# EAGLE design pendant (EAGLE 7.2.0)
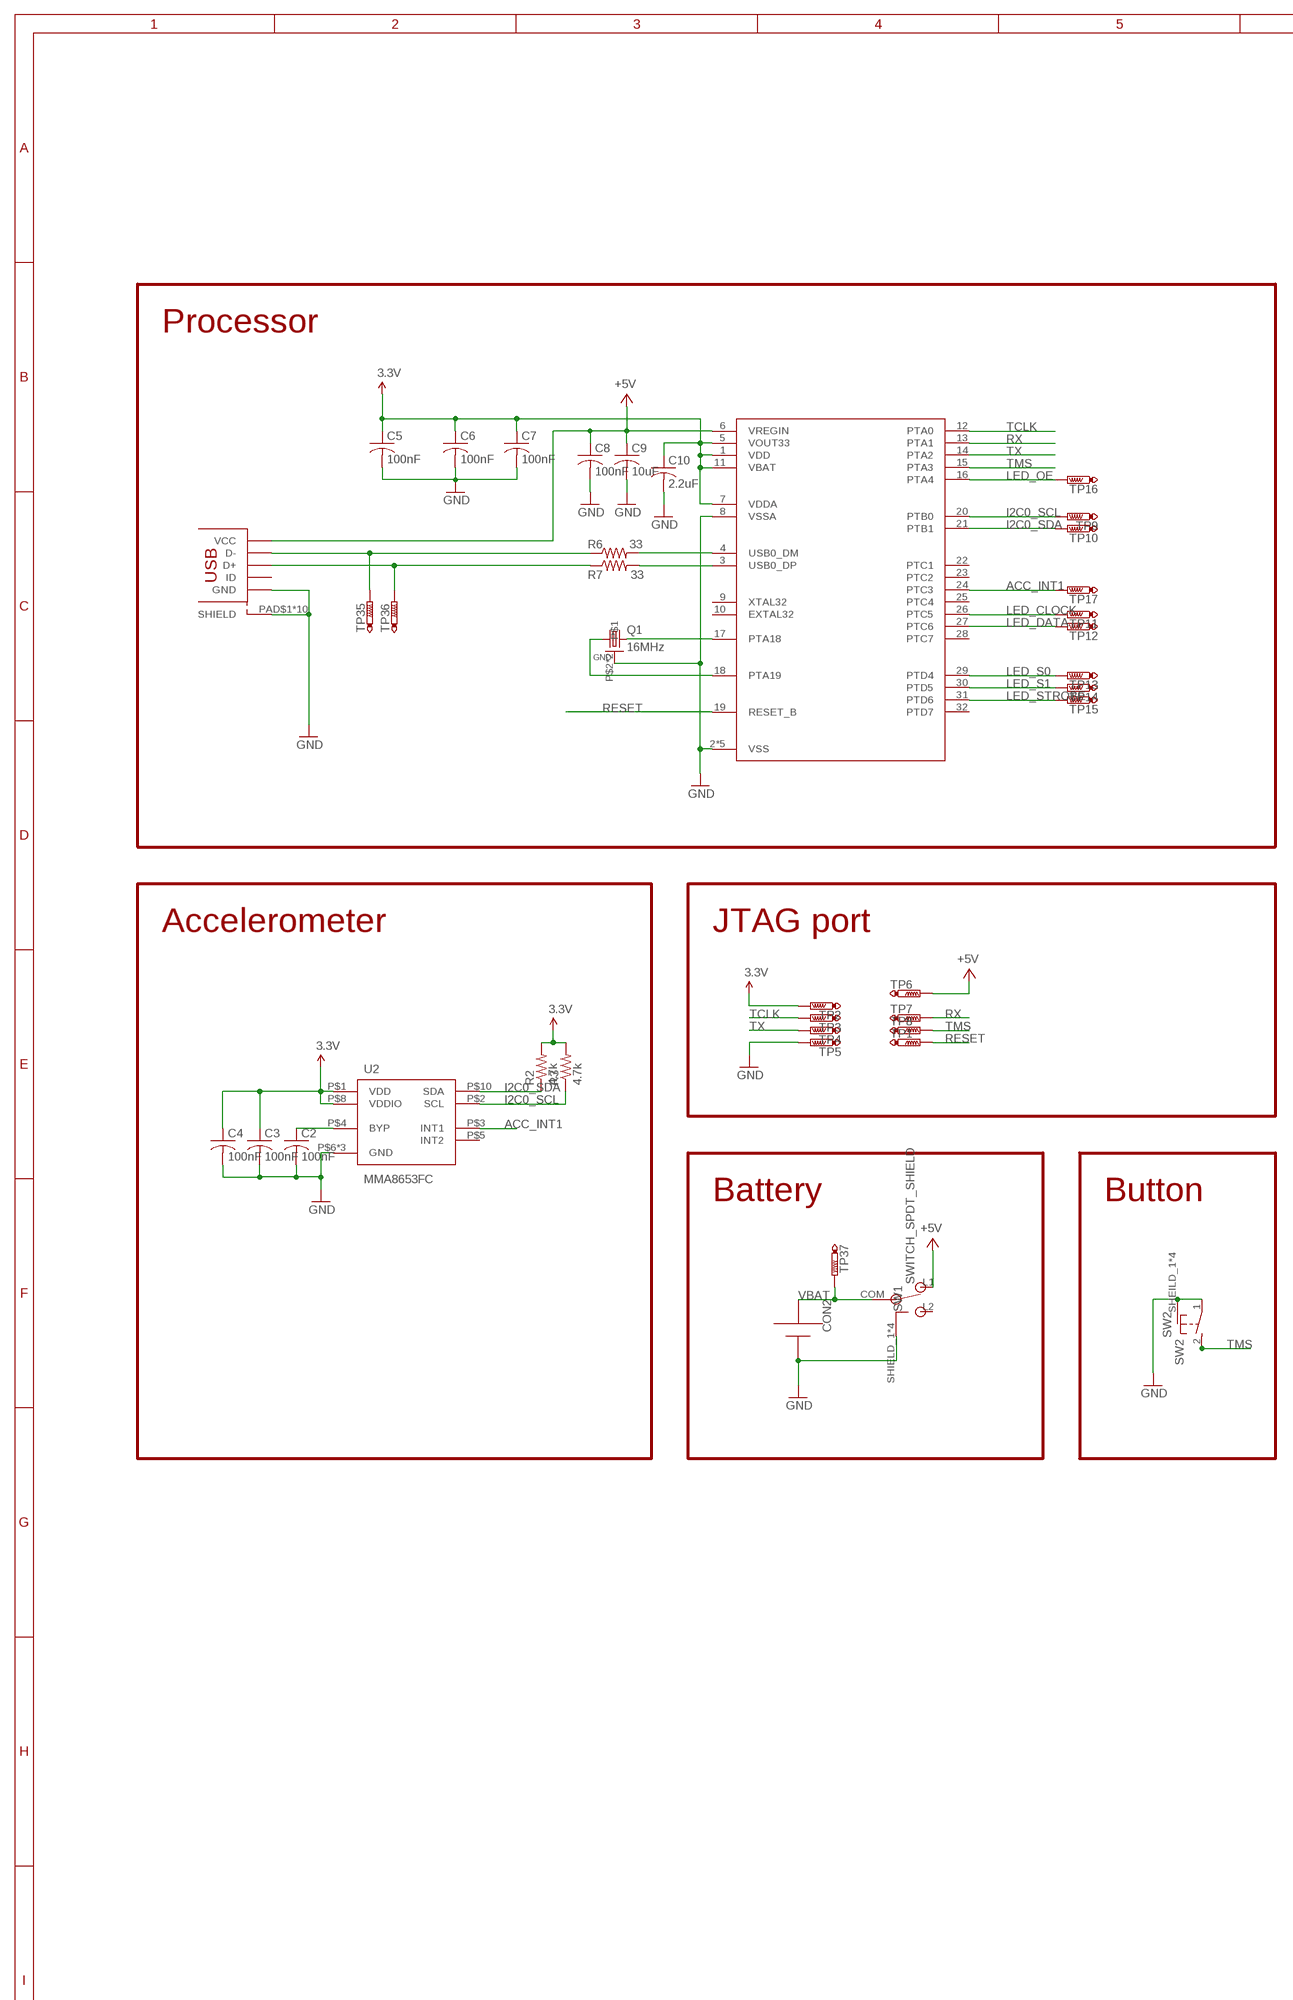
[diagram p0: schematic, sheet 1, part 1 of 2]
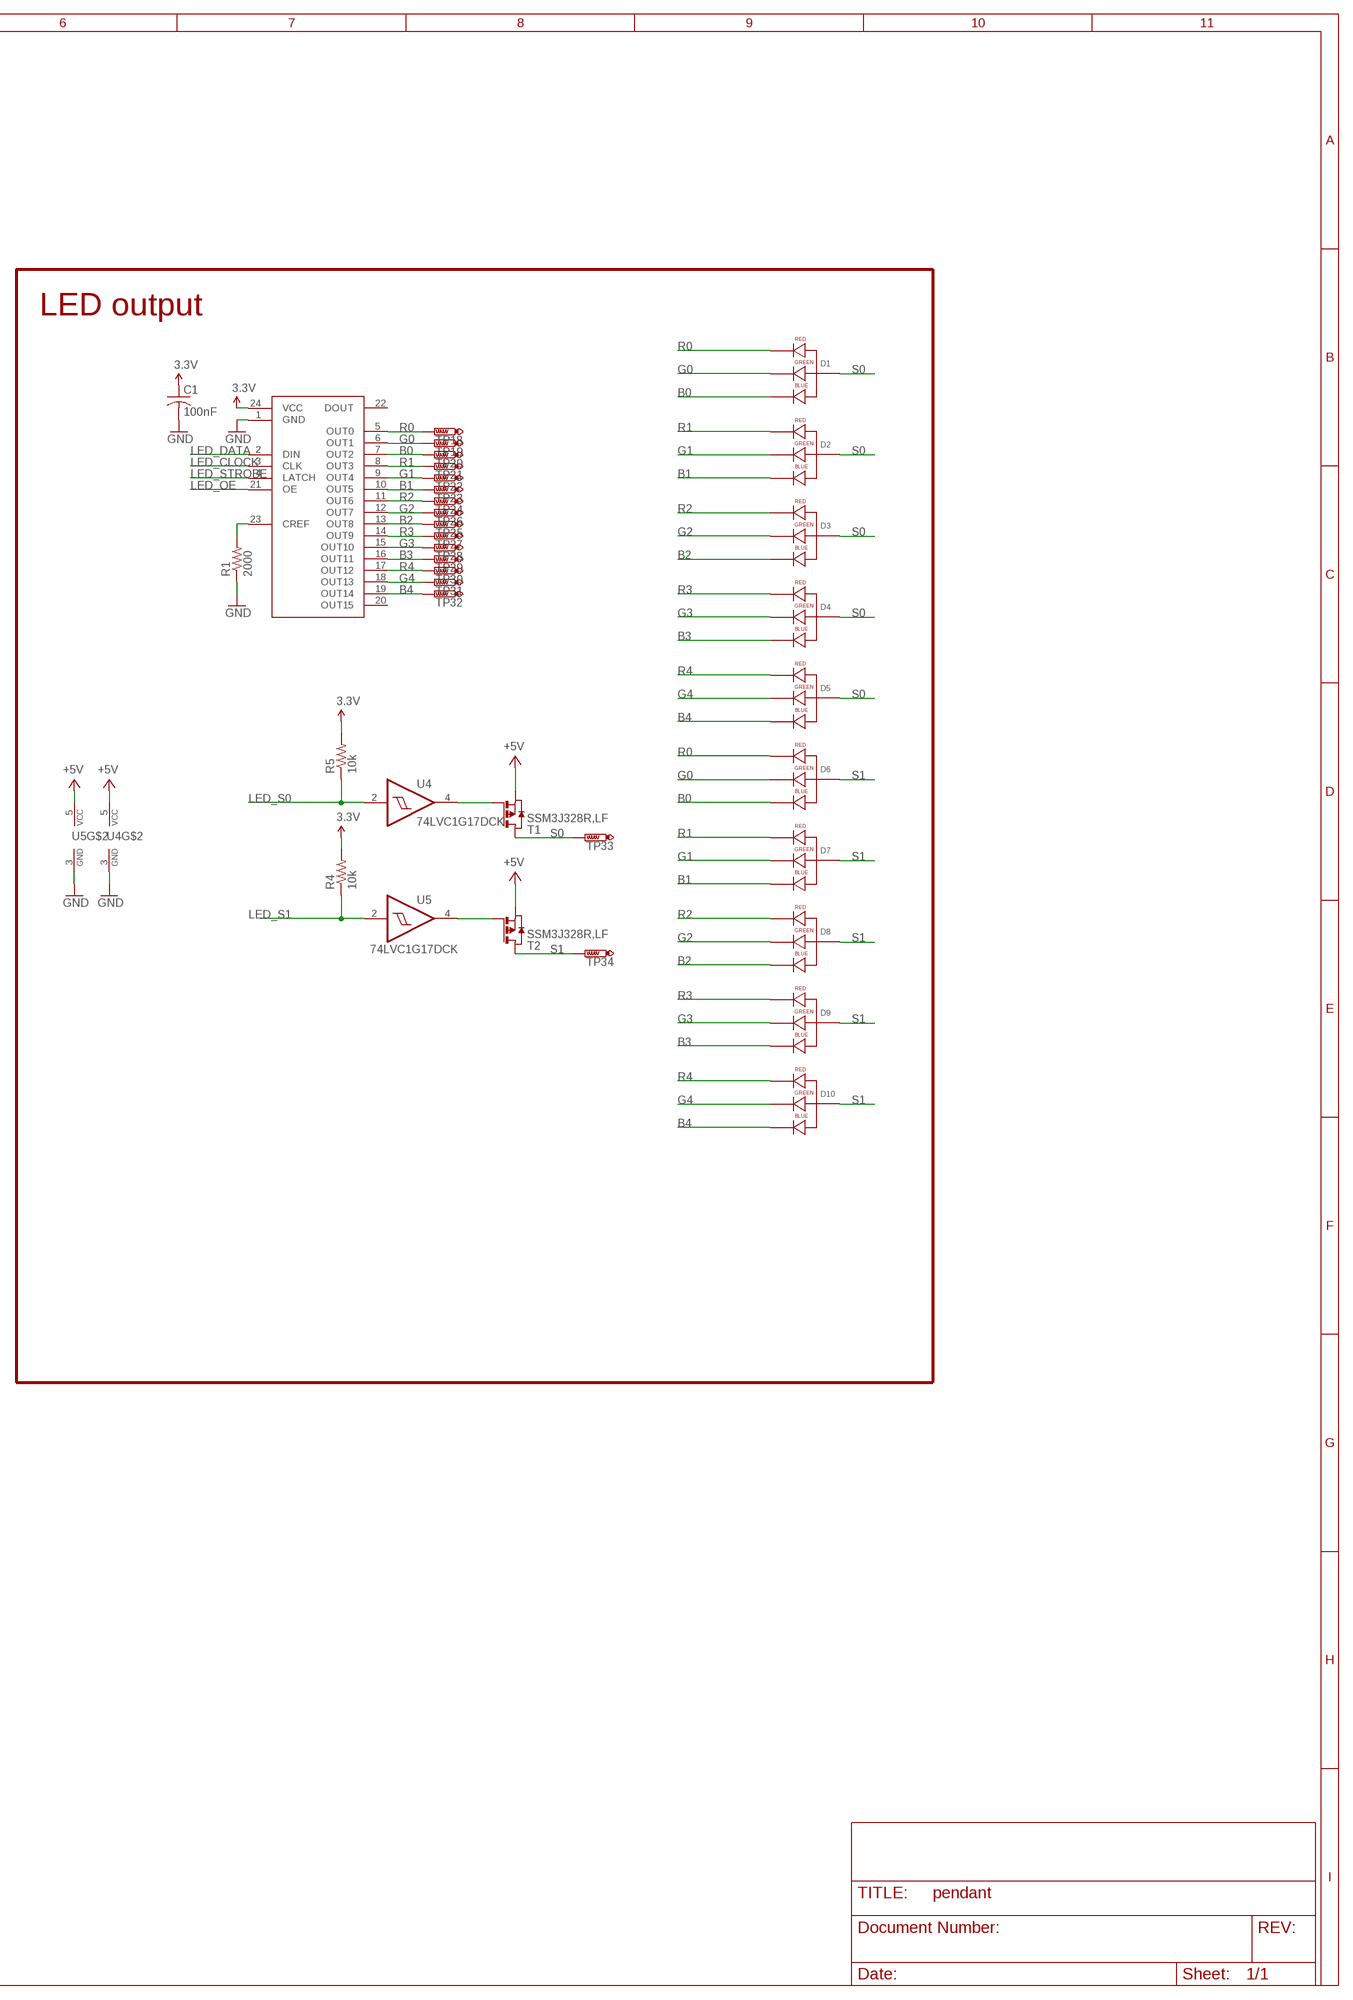
[diagram p1: schematic, sheet 1, part 2 of 2]

## Parts
C1  100nF  C-USC0402  [C0402]
C2  100nF  C-USC0402  [C0402]
C3  100nF  C-USC0402  [C0402]
C4  100nF  C-USC0402  [C0402]
C5  100nF  C-USC0402  [C0402]
C6  100nF  C-USC0402  [C0402]
C7  100nF  C-USC0402  [C0402]
C8  100nF  C-USC0402  [C0402]
C9  10uF  C-USC0603  [C0603]
C10  2.2uF  C-USC0402  [C0402]
CON1  USB_MICROSMT+THRUHULE  [USB_MICRO_THRUHOLE]
CON2  CR2032X2  [CR2032X2]
D1  LED-RGB5050  [LED-TRICOLOR-5050-FIXED]
D2  LED-RGB5050  [LED-TRICOLOR-5050-FIXED]
D3  LED-RGB5050  [LED-TRICOLOR-5050-FIXED]
D4  LED-RGB5050  [LED-TRICOLOR-5050-FIXED]
D5  LED-RGB5050  [LED-TRICOLOR-5050-FIXED]
D6  LED-RGB5050  [LED-TRICOLOR-5050-FIXED]
D7  LED-RGB5050  [LED-TRICOLOR-5050-FIXED]
D8  LED-RGB5050  [LED-TRICOLOR-5050-FIXED]
D9  LED-RGB5050  [LED-TRICOLOR-5050-FIXED]
D10  LED-RGB5050  [LED-TRICOLOR-5050-FIXED]
Q1  16MHz  CRYSTAL_4PAD  [CRYSTAL_3225]
R1  2000  R-US_R0402  [R0402]
R2  4.7k  R-US_R0402  [R0402]
R3  4.7k  R-US_R0402  [R0402]
R4  10k  R-US_R0402  [R0402]
R5  10k  R-US_R0402  [R0402]
R6  33  R-US_R0402  [R0402]
R7  33  R-US_R0402  [R0402]
SW1  SWITCH_SPDT_SHIELD  [SWITCH_SMD_90_DEGREE]
SW2  SW2  BUTTON_MOMENTARY_GROUND  [BUTTON_MOMENTARY_MP5]
T1  SSM3J328R,LF  PMOSSOT23  [SOT-23]
T2  SSM3J328R,LF  PMOSSOT23  [SOT-23]
TP1  PTR1B1,27  [B1,27]
TP2  PTR1B1,27  [B1,27]
TP3  PTR1B1,27  [B1,27]
TP4  PTR1B1,27  [B1,27]
TP5  PTR1B1,27  [B1,27]
TP6  PTR1B1,27  [B1,27]
TP7  PTR1B1,27  [B1,27]
TP8  PTR1B1,27  [B1,27]
TP9  PTR1B1,27  [B1,27]
TP10  PTR1B1,27  [B1,27]
TP11  PTR1B1,27  [B1,27]
TP12  PTR1B1,27  [B1,27]
TP13  PTR1B1,27  [B1,27]
TP14  PTR1B1,27  [B1,27]
TP15  PTR1B1,27  [B1,27]
TP16  PTR1B1,27  [B1,27]
TP17  PTR1B1,27  [B1,27]
TP18  PTR1B1,27  [B1,27]
TP19  PTR1B1,27  [B1,27]
TP20  PTR1B1,27  [B1,27]
TP21  PTR1B1,27  [B1,27]
TP22  PTR1B1,27  [B1,27]
TP23  PTR1B1,27  [B1,27]
TP24  PTR1B1,27  [B1,27]
TP25  PTR1B1,27  [B1,27]
TP26  PTR1B1,27  [B1,27]
TP27  PTR1B1,27  [B1,27]
TP28  PTR1B1,27  [B1,27]
TP29  PTR1B1,27  [B1,27]
TP30  PTR1B1,27  [B1,27]
TP31  PTR1B1,27  [B1,27]
TP32  PTR1B1,27  [B1,27]
TP33  PTR1B1,27  [B1,27]
TP34  PTR1B1,27  [B1,27]
TP35  PTR1B1,27  [B1,27]
TP36  PTR1B1,27  [B1,27]
TP37  PTR1B1,27  [B1,27]
U1  MK20D--VFM5  [QFN32_5X5_LONGLEADS]
U2  MMA8653FC  [VFDFN-10]
U3  ICN2026DF  [SMD-24-1MM]
U4  74LVC1G17DCK  [SC70-5]
U5  74LVC1G17DCK  [SC70-5]

## Nets
3.3V [power]: C1.1 C3.1 C4.1 C5.1 C6.1 C7.1 C10.1 R2.2 R3.2 R4.2 R5.2 TP2.TP U1.1(VDD) U1.5(VOUT33) U1.7(VDDA) U1.11(VBAT) U2.P$1(VDD) U2.P$8(VDDIO) U3.24(VCC)
+5V [power]: C8.1 C9.1 CON1.PIN$1(VCC) SW1.L1 T1.2(S) T2.2(S) TP6.TP U1.6(VREGIN) U4.5(VCC) U5.5(VCC)
ACC_INT1: TP17.TP U1.24(PTC3) U2.P$3(INT1)
B0: D1.1(BLUE_CATHODE) D6.1(BLUE_CATHODE) TP20.TP U3.7(OUT2)
B1: D2.1(BLUE_CATHODE) D7.1(BLUE_CATHODE) TP23.TP U3.10(OUT5)
B2: D3.1(BLUE_CATHODE) D8.1(BLUE_CATHODE) TP25.TP U3.13(OUT8)
B3: D4.1(BLUE_CATHODE) D9.1(BLUE_CATHODE) TP29.TP U3.16(OUT11)
B4: D5.1(BLUE_CATHODE) D10.1(BLUE_CATHODE) TP32.TP U3.19(OUT14)
G0: D1.3(GREEN_CATHODE) D6.3(GREEN_CATHODE) TP19.TP U3.6(OUT1)
G1: D2.3(GREEN_CATHODE) D7.3(GREEN_CATHODE) TP22.TP U3.9(OUT4)
G2: D3.3(GREEN_CATHODE) D8.3(GREEN_CATHODE) TP26.TP U3.12(OUT7)
G3: D4.3(GREEN_CATHODE) D9.3(GREEN_CATHODE) TP28.TP U3.15(OUT10)
G4: D5.3(GREEN_CATHODE) D10.3(GREEN_CATHODE) TP31.TP U3.18(OUT13)
GND [power]: C1.2 C2.2 C3.2 C4.2 C5.2 C6.2 C7.2 C8.2 C9.2 C10.2 CON1.PAD$1(SHIELD) CON1.PAD$2(SHIELD) CON1.PAD$3(SHIELD) CON1.PAD$4(SHIELD) CON1.PAD$5(SHIELD) CON1.PAD$6(SHIELD) CON1.PAD$7(SHIELD) CON1.PAD$8(SHIELD) CON1.PAD$9(SHIELD) CON1.PAD$10(SHIELD) CON1.PIN$5(GND) CON2.- Q1.P$2 Q1.P$4 R1.1 SW1.SHIELD_1(SHIELD) SW1.SHIELD_2(SHIELD) SW1.SHIELD_3(SHIELD) SW1.SHIELD_4(SHIELD) SW2.1(P) SW2.SHEILD_1(SHIELD) SW2.SHEILD_2(SHIELD) SW2.SHEILD_3(SHIELD) SW2.SHEILD_4(SHIELD) TP5.TP U1.2(VSS) U1.8(VSSA) U1.PAD@1(VSS) U1.PAD@4(VSS) U1.PAD@9(VSS) U1.PAD@11(VSS) U2.P$6(GND) U2.P$7(GND) U2.P$9(GND) U3.1(GND) U4.3(GND) U5.3(GND)
I2C0_SCL: R3.1 TP9.TP U1.20(PTB0) U2.P$2(SCL)
I2C0_SDA: R2.1 TP10.TP U1.21(PTB1) U2.P$10(SDA)
LED_CLOCK: TP11.TP U1.26(PTC5) U3.3(CLK)
LED_DATA: TP12.TP U1.27(PTC6) U3.2(DIN)
LED_OE: TP16.TP U1.16(PTA4) U3.21(OE)
LED_S0: R5.1 TP13.TP U1.29(PTD4) U4.2(I)
LED_S1: R4.1 TP14.TP U1.30(PTD5) U5.2(I)
LED_STROBE: TP15.TP U1.31(PTD6) U3.4(LATCH)
N$1: T2.3(G) U5.4(O)
N$4: C2.1 U2.P$4(BYP)
N$6: T1.3(G) U4.4(O)
N$8: Q1.P$3 U1.17(PTA18)
N$13: Q1.P$1 U1.18(PTA19)
N$14: CON1.PIN$3(D+) R7.1 TP36.TP
N$15: R6.2 U1.4(USB0_DM)
N$17: R7.2 U1.3(USB0_DP)
N$18: R1.2 U3.23(CREF)
N$21: CON1.PIN$2(D-) R6.1 TP35.TP
R0: D1.2(RED_CATHODE) D6.2(RED_CATHODE) TP18.TP U3.5(OUT0)
R1: D2.2(RED_CATHODE) D7.2(RED_CATHODE) TP21.TP U3.8(OUT3)
R2: D3.2(RED_CATHODE) D8.2(RED_CATHODE) TP24.TP U3.11(OUT6)
R3: D4.2(RED_CATHODE) D9.2(RED_CATHODE) TP27.TP U3.14(OUT9)
R4: D5.2(RED_CATHODE) D10.2(RED_CATHODE) TP30.TP U3.17(OUT12)
RESET: TP1.TP U1.19(RESET_B)
RX: TP7.TP U1.13(PTA1)
S0: D1.4(ANODE) D1.5(ANODE) D1.6(ANODE) D2.4(ANODE) D2.5(ANODE) D2.6(ANODE) D3.4(ANODE) D3.5(ANODE) D3.6(ANODE) D4.4(ANODE) D4.5(ANODE) D4.6(ANODE) D5.4(ANODE) D5.5(ANODE) D5.6(ANODE) T1.1(D) TP33.TP
S1: D6.4(ANODE) D6.5(ANODE) D6.6(ANODE) D7.4(ANODE) D7.5(ANODE) D7.6(ANODE) D8.4(ANODE) D8.5(ANODE) D8.6(ANODE) D9.4(ANODE) D9.5(ANODE) D9.6(ANODE) D10.4(ANODE) D10.5(ANODE) D10.6(ANODE) T2.1(D) TP34.TP
TCLK: TP3.TP U1.12(PTA0)
TMS: SW2.2(S) TP8.TP U1.15(PTA3)
TX: TP4.TP U1.14(PTA2)
VBAT: CON2.+ SW1.COM TP37.TP
Unconnected: CON1.PIN$4(ID) SW1.L2 U1.9(XTAL32) U1.10(EXTAL32) U1.22(PTC1) U1.23(PTC2) U1.25(PTC4) U1.28(PTC7) U1.32(PTD7) U2.P$5(INT2) U3.20(OUT15) U3.22(DOUT)

## Notes on the sheet
- Processor | LED output
- Accelerometer | JTAG port
- Battery | Button

## Library data of the parts
C1-C10 = adafruit:C-US: CAPACITOR, American symbol
CON1 = blinkinlabs:USB_MICRO
CON2 = blinkinlabs:CR2032X2
D1-D10 = blinkinlabs:LED-RGB: RGB Through-hole common anode SparkFun store front COM-10821 (diffuse) COM-10820 (clear)
Q1 = blinkinlabs:CRYSTAL_4PAD
R1-R7 = adafruit:R-US_: RESISTOR, American symbol
SW1 = blinkinlabs:SWITCH_SPDT_SHIELD
SW2 = blinkinlabs:BUTTON_MOMENTARY_GROUND
T1 T2 = zetex:PMOSSOT23: MOS FET; OC_FARNELL: unknown; OC_NEWARK: unknown
TP1-TP37 = testpad:PTR1: TEST PIN
U1 = blinkinlabs:MK20D--VFM5
U2 = teensy_adapter:MMA8653FC
U3 = teensy_adapter:ICN2026DF
U4 U5 = 74xx-little-us:74*1G17: Single Schmitt-Trigger Buffer

## Net classes
0 default: width 0.254 mm, drill 0.35 mm
1 power: width 0.254 mm, drill 0.35 mm

## Board
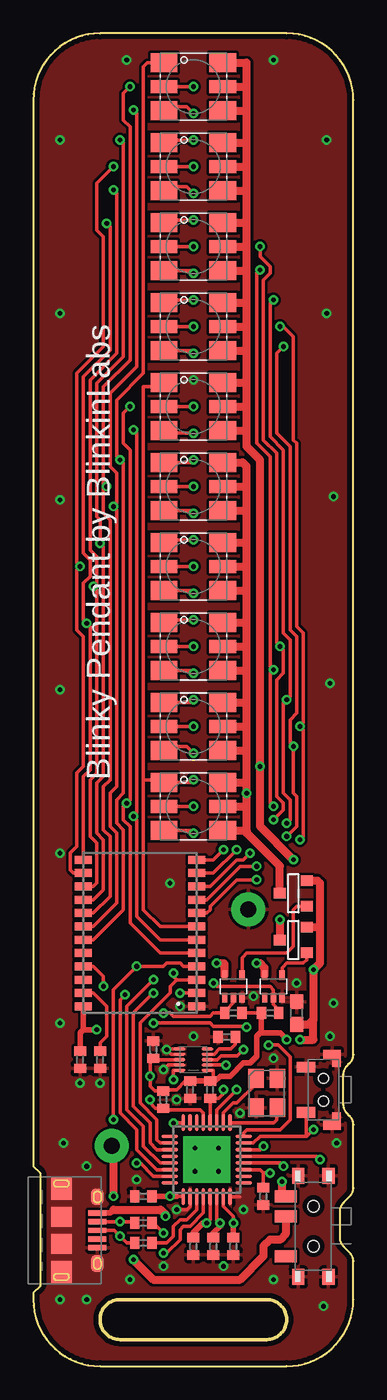
[diagram p2: board, top side]
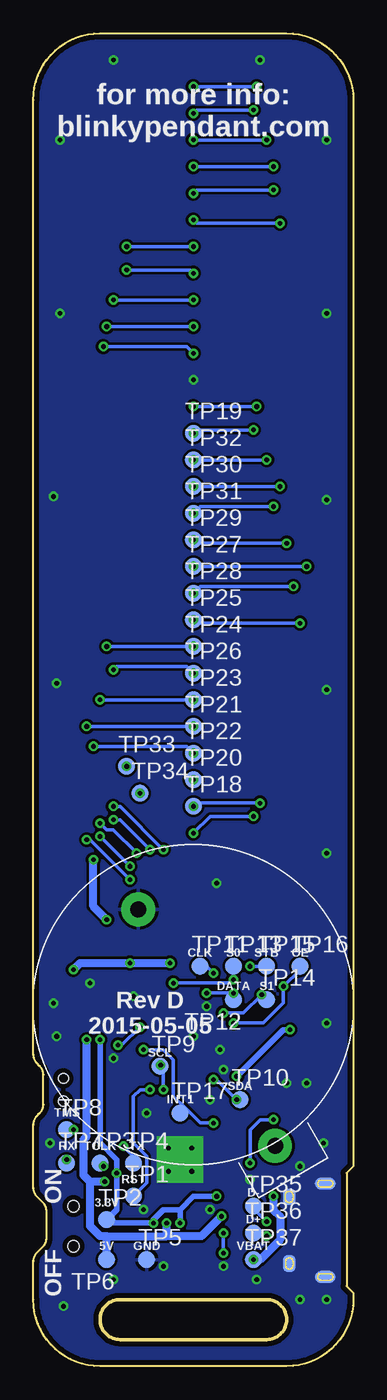
[diagram p3: board, bottom side, seen from below]

Size 24 x 100 mm. Coordinates in mm from the lower left corner, seen from the top.
Outline: 0,95 0,15 0.5,14.5 0.5,6 0,5.5 0,5 arc90 5,0 19,0 arc90 24,5 24,7.84 arc45 23.71,8.54 23.29,8.96 arc-45 23,9.66 23,11.59 arc-45 23.29,12.29 23.71,12.71 arc45 24,13.41 24,18.09 arc45 23.71,18.79 23.54,18.96 arc-45 23.25,19.66 23.25,21.84 arc-45 23.54,22.54 23.71,22.71 arc45 24,23.41 24,95 arc90 19,100 5,100 arc90 0,95
Outline: 5,3.5 arc90 6.5,2 17.5,2 arc90 19,3.5 arc90 17.5,5 6.5,5 arc90 5,3.5
Copper layers (1*16): Top 0.0356mm / dielectric 1.5011mm / Bottom 0.0356mm
Design rules "BlinkyTape *": minimum track width 0.25mm, minimum drill 0.3mm, track to track 0.2mm, track to pad 0.2mm, pad to pad 0.2mm, via to via 0.2mm, smd to smd 0.2mm, copper to edge 15mil, drill to drill 0.25mm, minimum pad ring 5mil, minimum via ring 7mil, stop-mask expansion 2mil, vias tented up to drill 0.35mm, thermal gap 10mil
tRestrict: area 11,13.5 to 11.2,17.5; area 11.2,13.5 to 15,13.8; area 14.8,13.8 to 15,17.5; area 11.2,17.2 to 14.8,17.5; area 11.5,22 to 12.5,24; area 10.8,23.6 to 11.5,23.6; area 10.8,24.1 to 11.5,24.1

### Footprints (pad centres in the part's own frame; a part is rotated, then mirrored left to right if it is on the bottom)
C0402 = smd 0.7 x 0.9: 1 -0.65,0; 2 0.65,0
C0603 = smd 1.1 x 1: 1 -0.85,0; 2 0.85,0
USB_MICRO_THRUHOLE = smd 1.645 x 1.55: PAD$1 -3.123,0; PAD$4 3.123,0 | smd 1.5 x 1.55: PAD$2 -1,0; PAD$3 1,0 | smd 1.25 x 0.95: PAD$5 -2.5,2.7; PAD$6 2.5,2.7 | smd 0.9 x 1.55 bottom: PAD$7 -3.5,0; PAD$8 3.5,0 | smd 1.25 x 0.95 bottom: PAD$9 -2.5,2.7; PAD$10 2.5,2.7 | smd 0.4 x 1.35: PIN$1 -1.3,2.7; PIN$2 -0.65,2.7; PIN$3 0,2.7; PIN$4 0.65,2.7; PIN$5 1.3,2.7
CR2032X2 = drill 1.2 pad 2.54: + 13.25,0; - -7.25,0
LED-TRICOLOR-5050-FIXED = smd 2 x 1.4: 1 -2.2,1.8; 3 -2.2,-1.8; 4 2.2,-1.8; 6 2.2,1.8 | smd 2 x 1: 2 -2.2,0; 5 2.2,0
CRYSTAL_3225 = smd 1.4 x 1.15: P$1 -1.1,-0.8; P$2 1.1,-0.8; P$3 1.1,0.8; P$4 -1.1,0.8
R0402 = smd 0.7 x 0.9: 1 -0.65,0; 2 0.65,0
SWITCH_SMD_90_DEGREE = smd 0.9 x 1.65: COM -0.75,-2.075; L1 -2.25,-2.075; L2 2.25,-2.075 | smd 1.2 x 0.93: SHIELD_1 -3.8,1.135; SHIELD_2 -3.8,-1.135; SHIELD_3 3.8,1.135; SHIELD_4 3.8,-1.135 | hole 0.85: -1.5,0; 1.5,0
BUTTON_MOMENTARY_MP5 = smd 0.8 x 1.4: 1 -1.7,-1.3; 2 1.7,-1.3 | smd 0.7 x 1.3: SHEILD_1 -2.65,0.65; SHEILD_4 2.65,0.65 | smd 0.6 x 0.65: SHEILD_2 -2,0.975; SHEILD_3 2,0.975 | hole 0.75: 0.85,0; -0.85,0
SOT-23 = smd 0.787 x 0.889: 1 0.025,-1.016; 2 -0.94,1.016; 3 0.991,1.016
B1,27 = smd 1.27 x 1.27: TP 0,0
QFN32_5X5_LONGLEADS = smd 1.25 x 0.275: 1 -2.775,1.75; 2 -2.775,1.25; 3 -2.775,0.75; 4 -2.775,0.25; 5 -2.775,-0.25; 6 -2.775,-0.75; 7 -2.775,-1.25; 8 -2.775,-1.75; 17 2.775,-1.75; 18 2.775,-1.25; 19 2.775,-0.75; 20 2.775,-0.25; 21 2.775,0.25; 22 2.775,0.75; 23 2.775,1.25; 24 2.775,1.75 | smd 0.275 x 1.25: 9 -1.75,-2.775; 10 -1.25,-2.775; 11 -0.75,-2.775; 12 -0.25,-2.775; 13 0.25,-2.775; 14 0.75,-2.775; 15 1.25,-2.775; 16 1.75,-2.775; 25 1.75,2.775; 26 1.25,2.775; 27 0.75,2.775; 28 0.25,2.775; 29 -0.25,2.775; 30 -0.75,2.775; 31 -1.25,2.775; 32 -1.75,2.775 | drill 0.35 pad 1.75 square: PAD@1 -0.875,0.875; PAD@4 0.875,0.875; PAD@11 0.875,-0.875 | drill 0.35 pad 1.76 square: PAD@9 -0.875,-0.875
VFDFN-10 = smd 0.9 x 0.225: P$1 -1.05,0.8; P$2 -1.05,0.4; P$3 -1.05,0; P$4 -1.05,-0.4; P$5 -1.05,-0.8; P$6 1.05,-0.8; P$7 1.05,-0.4; P$8 1.05,0; P$9 1.05,0.4; P$10 1.05,0.8
SMD-24-1MM = smd 1.27 x 0.6: 1 -4.25,5.5; 2 -4.25,4.5; 3 -4.25,3.5; 4 -4.25,2.5; 5 -4.25,1.5; 6 -4.25,0.5; 7 -4.25,-0.5; 8 -4.25,-1.5; 9 -4.25,-2.5; 10 -4.25,-3.5; 11 -4.25,-4.5; 12 -4.25,-5.5; 13 4.25,-5.5; 14 4.25,-4.5; 15 4.25,-3.5; 16 4.25,-2.5; 17 4.25,-1.5; 18 4.25,-0.5; 19 4.25,0.5; 20 4.25,1.5; 21 4.25,2.5; 22 4.25,3.5; 23 4.25,4.5; 24 4.25,5.5
SC70-5 = smd 0.4 x 0.7: 1 -0.65,-0.85; 2 0,-0.85; 3 0.65,-0.85; 4 0.65,0.85; 5 -0.65,0.85

### Placement (x,y rotation side)
C1  3.5,23 270 top
C2  14.5,24.7 180 top
C3  11.75,20.75 270 top
C4  9,23.75 90 top
C5  8.25,12.75 180 top
C6  15,9 270 top
C7  17.25,12.75 270 top
C8  13.5,9 270 top
C9  19.75,26.5 90 top
C10  12,9 270 top
CON1  2.1,10.2 270 top
CON2  12.5,28 300 bottom
D1  12,72 0 top
D2  12,78 0 top
D3  12,84 0 top
D4  12,90 0 top
D5  12,96 0 top
D6  12,42 0 top
D7  12,48 0 top
D8  12,54 0 top
D9  12,60 0 top
D10  12,66 0 top
Q1  17.5,20.5 270 top
R1  5,23 90 top
R2  9.75,20 90 top
R3  13.25,20.75 90 top
R4  15,26.5 0 top
R5  17.75,26.5 180 top
R6  8.25,10.75 0 top
R7  8.25,9.25 0 top
SW1  21,10.5 270 top
SW2  21.75,20.75 270 top
T1  19.5,32 270 top
T2  19.5,35.5 270 top
TP1  16.5,12.75 0 bottom
TP2  18.5,11 0 bottom
TP3  19,15.25 0 bottom
TP4  16.5,15.25 0 bottom
TP5  15.5,8 0 bottom
TP6  18.5,8 180 bottom
TP7  21.5,15.25 0 bottom
TP8  21.5,17.75 0 bottom
TP9  14.5,22.5 0 bottom
TP10  8.5,20 0 bottom
TP11  11.5,30 0 bottom
TP12  9,27.5 180 bottom
TP13  9,30 0 bottom
TP14  6.5,27.5 0 bottom
TP15  6.5,30 0 bottom
TP16  4,30 0 bottom
TP17  13,19 0 bottom
TP18  12,42 0 bottom
TP19  12,70 0 bottom
TP20  12,44 0 bottom
TP21  12,48 0 bottom
TP22  12,46 0 bottom
TP23  12,50 0 bottom
TP24  12,54 0 bottom
TP25  12,56 0 bottom
TP26  12,52 0 bottom
TP27  12,60 0 bottom
TP28  12,58 0 bottom
TP29  12,62 0 bottom
TP30  12,66 0 bottom
TP31  12,64 0 bottom
TP32  12,68 0 bottom
TP33  17,45 0 bottom
TP34  16,43 0 bottom
TP35  7.5,12 0 bottom
TP36  7.5,10 0 bottom
TP37  7.5,8 0 bottom
U1  13,15.5 90 top
U2  12,23 180 top
U3  8,32.5 180 top
U4  18,28.5 0 top
U5  15,28.5 0 top

### Tracks (layer width: path | path; a pad name or v marks a point on that pad's centre or on a via)
3.3V  (via drill 0.35)
  Top 0.254: 11.25,12.25 U1.1 11.22,12.75 10.75,12.75 | U1.5 13.25,11 v13,10.75 | U1.7 14.25,12 15,11.25 v15,10.75 | U2.P$8 9.1,23 C4.1 | U2.P$1 13.5,22.2 13.5,21.5 13.35,21.5 | C4.1 8.85,23.1 8.75,23 | R4.2 R5.2 | R3.2 13.4,21.4 | C4.1 8.75,22.85 v8.75,21.75 8.75,21 9.1,20.65 R2.2 9.85,20.75 10.75,20.75 11.4,21.4 C3.1 | C7.1 17.25,14.5 | v17.75,14.5 17.25,14.5 | U1.11 17,14.75 17.25,14.5
  Top 0.406: v15,10.75 C6.1 | C10.1 11.9,9.65 12,9.75 12,10 12.75,10.75 v13,10.75 | U3.24 3.75,25.25 | C3.1 R3.2 | 13.35,21.5 R3.2 | 17.1,25 18.5,25 v19,24.5 | 17.1,25 17,25 16.75,24.75 16.75,23.25 16.25,22.75 15.75,22.75 14.75,21.75 14,21.75 13.65,21.4 R3.2 | R5.2 17.1,25 | 10.75,12.75 v10.25,12.75 C5.1 | C1.1 3.5,25 3.75,25.25 | 3.75,25.25 v4.75,25.25
  Bottom 0.406: v4.75,25.25 5.25,25.25 v8.75,21.75 | 13,11.75 12,12.75 v10.25,12.75 | 13,11.75 v13,10.75 | 13,11.75 14.25,11.75 15,11 v15,10.75 18.25,10.75 TP2.TP 17.75,11.75 v17.75,14.5 17.75,15.5 19,16.75 v19,24.5
+5V  (via drill 0.35)
  Top 0.254: U1.6 13.75,11 v14,10.75
  Top 0.406: C8.1 13.4,9.65 13.5,9.75 13.5,10 14,10.5 v14,10.75 | CON1.PIN$1 5.75,11.5 6,11.75
  Top 0.61: 6,11.75 9.55,11.75 9.9,11.4 v9.9,11.25 | v16.75,30.25 17,30.25 17.35,29.9 U4.5 | U5.5 14.35,30.15 14.25,30.25 v13.75,30.25 | 21.5,32.75 21.5,30.25 v21,29.75 21,26 | 21.5,32.75 21.5,36.25 21.31,36.44 T2.2 | T1.2 21.31,32.94 21.5,32.75 | 21,26 20.65,25.65 C9.1 | v20,24.5 21,24.5 21,26 | SW1.L1 18.65,13.03 v18.65,13.85
  Bottom 0.61: v9.9,11.25 11.4,9.75 14,9.75 | 18.5,9.75 14,9.75 | 14,9.75 v14,10.75 | TP6.TP 18.5,9.75 | v21,29.75 20.5,30.25 v16.75,30.25 v13.75,30.25 | 18.5,9.75 19,9.75 19.75,10.5 19.75,13.85 | v20,24.5 20,17.25 20.25,17 20.25,14.35 19.75,13.85 | v18.65,13.85 19.75,13.85
ACC_INT1  (via drill 0.35)
  Top 0.254: U1.24 10.53,18.27 v10.5,18.25 | U2.P$3 13.8,23 14.1,23.3 15.3,23.3 v15.75,23.75
  Bottom 0.254: v10.5,18.25 11.5,18.25 12.62,19.38 | 12.62,19.38 13.5,20.25 13.5,23 14.25,23.75 v15.75,23.75 | TP17.TP 12.62,19.38
B0  (via drill 0.35)
  Top 0.254: U3.7 9.5,33 8.25,34.25 8.25,44 | 8.25,44 8.25,73.5 9.5,73.5 D1.1 | 8.25,44 9.6,44 D6.1 11.8,43.8 TP20.TP
  other vias: 12,44
B1  (via drill 0.35)
  Top 0.254: U3.10 13.25,36 15.25,38 15.75,38 v16.25,38.5 | v19,40.75 19.25,41 19.25,42.5 18.75,43 18.75,49.75 v19,50 19.25,50.25 19.25,54.5 18.75,55 18.75,68.75 17.75,69.75 17.75,79.75 v18,80 | v12,80 10,80 D2.1 | D7.1 11.8,49.8 TP23.TP
  Bottom 0.254: v16.25,38.5 18,40.25 18.5,40.25 v19,40.75 | v18,80 v12,80 | TP23.TP v19,50
  other vias: 12,50
B2  (via drill 0.35)
  Top 0.254: U3.13 3.75,44.25 4.25,44.75 4.25,55.5 v4,55.75 3.75,56 3.75,58.75 4.25,59.25 4.25,60.5 3.75,61 3.75,74.25 5.75,76.25 5.75,85.5 v5.5,85.75 | v12,86 10,86 D3.1 | TP25.TP 10,56 D8.1
  Bottom 0.254: v5.5,85.75 11.75,85.75 v12,86 | v4,55.75 11.75,55.75 TP25.TP
  other vias: 12,56
B3  (via drill 0.35)
  Top 0.254: U3.16 4.5,35 5.25,35.75 5.25,39.5 4.75,40 4.75,43.75 5.25,44.25 5.25,61.5 v5,61.75 5,63.5 4.75,63.75 4.75,73.75 6.75,75.75 6.75,91.75 v6.5,92 | TP29.TP 10,62 D9.1 | v12,92 10,92 D4.1
  Bottom 0.254: v5,61.75 11.75,61.75 TP29.TP | v6.5,92 v12,92
  other vias: 12,62
B4  (via drill 0.35)
  Top 0.254: U3.19 4.5,32 6.75,34.25 6.75,40.25 6.25,40.75 6.25,42.5 6.75,43 6.75,67.75 v6.5,68 6.25,68.25 6.25,72.5 8.25,74.5 8.25,97.5 8.55,97.8 D5.1 | D10.1 11.8,67.8 TP32.TP
  Bottom 0.254: TP32.TP v6.5,68
  other vias: 12,68
G0  (via drill 0.35)
  Top 0.254: U3.6 9.5,32 7.75,33.75 7.75,41 v7.5,41.25 7.75,41.5 7.75,70 v7.5,70.25 | TP19.TP 10,70 D1.3 | D6.3 11.8,40.2 v12,40
  Bottom 0.254: v7.5,70.25 11.75,70.25 TP19.TP | v7.5,41.25 10.75,41.25 v12,40
  other vias: 12,70
G1  (via drill 0.35)
  Top 0.254: v18.75,76.5 18.25,76 18.25,70 19.25,69 19.25,55.25 19.75,54.75 19.75,49 19.25,48.5 19.25,46.75 v19.5,46.5 19.5,43 19.75,42.75 19.75,40.5 v19,39.75 | v16.75,37.5 15.5,37.5 13,35 U3.9 | TP22.TP 11.5,46.5 10.1,46.5 D7.3 | D2.3 11.8,76.2 v12,76
  Bottom 0.254: v12,76 12.5,76.5 v18.75,76.5 | TP22.TP 12.5,46.5 v19.5,46.5 | v19,39.75 v16.75,37.5
  other vias: 12,46
G2  (via drill 0.35)
  Top 0.254: v18,42 17.75,42.25 17.75,52 v18,52.25 17.75,52.5 17.75,68.25 16.75,69.25 16.75,82 v17,82.25 | U3.12 13.5,38 v14.25,38.75 | D8.3 11.8,52.2 TP26.TP | D3.3 11.8,82.2 v12,82
  Bottom 0.254: v17,82.25 12.25,82.25 v12,82 | TP26.TP 12.5,52.5 17.75,52.5 v18,52.25 | v18,42 17.5,42 v14.25,38.75
  other vias: 12,52
G3  (via drill 0.35)
  Top 0.254: U3.15 4.5,36 4.75,36.25 4.75,39.25 4.25,39.75 4.25,44 4.75,44.5 4.75,58.25 v4.5,58.5 4.75,58.75 4.75,60.75 4.25,61.25 4.25,74 6.25,76 6.25,88 v6,88.25 | v12,88 11.5,88.5 10.1,88.5 D4.3 | D9.3 11.8,58.2 TP28.TP
  Bottom 0.254: v6,88.25 11.75,88.25 v12,88 | TP28.TP 11.5,58.5 v4.5,58.5
  other vias: 12,58
G4  (via drill 0.35)
  Top 0.254: U3.18 4.5,33 6.25,34.75 6.25,40 5.75,40.5 5.75,43 6.25,43.5 6.25,64.25 v6,64.5 6.25,64.75 6.25,67 5.75,67.5 5.75,73 7.75,75 7.75,94 v7.5,94.25 | v12,94 11.5,94.5 10.1,94.5 D5.3 | D10.3 11.8,64.2 TP31.TP
  Bottom 0.254: v7.5,94.25 11.75,94.25 v12,94 | TP31.TP 11.5,64.5 v6,64.5
  other vias: 12,64
GND  (via drill 0.35)
  Top 0.254: U1.2 11.75,12 11.5,11.75 v10.75,11.75 | U1.8 15.47,12.72 | U2.P$9 10.1,22.6 v9.75,22.25 | U2.P$6 10.05,23.8 v10,23.75 10.35,23.4 U2.P$7
  Top 0.406: SW2.SHEILD_2 22.73,23.07 SW2.SHEILD_1 | SW2.SHEILD_3 22.73,18.43 SW2.SHEILD_4
  other vias: 15.75,11.75 22.75,16.75 14.25,7.5 15.5,19 18,23.1 10.75,20 5,21.25 3.5,21.25 16.5,27.75 19.75,28.75 11,27 12,24.75 7.25,6.5 4,5 22.25,24.75 22.5,27.25 2,5 2.25,16.75 2,25.75 2,38.5 2,50.75 2,65 2,79 2,92 7,98 18,98 22,92 22,79 22.5,65.25 22.25,51.25 9.75,7.5 7.75,14 18,6.5 21.75,4.5 10.25,36.25 12,74 4,15
  pour Top: 0,100 24,100 24,0 0,0 0,5.75 0,14.75
  pour Bottom: 0,100 24,100 24,0 0,0 0,5.75 0,14.75
I2C0_SCL  (via drill 0.35)
  Top 0.254: v14.25,20.75 14.25,20.45 13.9,20.1 R3.1 U1.20 | v14.45,22.6 U2.P$2
  Bottom 0.254: v14.25,20.75 14.25,22.5 14.35,22.6 v14.45,22.6 14.45,22.55 TP9.TP
I2C0_SDA  (via drill 0.35)
  Top 0.254: U1.21 12.75,19 12.5,19.25 9.85,19.25 R2.1 9.15,19.35 8.75,19.75 v8.75,20 | U2.P$10 10.5,22.2 v10.5,21.5
  Bottom 0.254: v10.5,21.5 10.25,21.5 v8.75,20 TP10.TP
LED_CLOCK  (via drill 0.35)
  Top 0.254: U3.3 10.75,29 | U1.26 9.5,16.75 9.25,17 9.25,18.5 8,19.75 8,25.75 10.25,28 10.25,28.5 10.75,29 | 10.75,29 10.5,29.25 v10.5,29.5
  Bottom 0.254: TP11.TP 11,30 v10.5,29.5
LED_DATA  (via drill 0.35)
  Top 0.254: U1.27 9.25,16.25 8.75,16.75 8.75,18.25 7.5,19.5 7.5,26.5 v9,28 | U3.2 v11,28
  Bottom 0.254: v11,28 v9,28 TP12.TP
LED_OE  (via drill 0.35)
  Top 0.254: U3.21 4.5,30 5.25,29.25 v5.25,28.5 | U1.16 15.78,17.52 16,17.75 18.5,17.75 19.25,18.5 19.25,23.2 18.35,24.1 v17.65,24.1 | v9,25.75 13.25,25.75 13.5,25.5 15.95,25.5 v16,25.45
  Bottom 0.254: v16,25.45 17.35,24.1 v17.65,24.1 | TP16.TP 4,29.75 v5.25,28.5 5.25,27.25 6.75,25.75 v9,25.75
LED_S0  (via drill 0.35)
  Top 0.254: U1.29 9.5,15.25 8.25,16.5 8.25,18 7,19.25 7,27 v9,29 | v13.5,28.75 13.75,28.5 17.75,28.5 18,28.25 U4.2 18,27.15 18.4,26.75 R5.1
  Bottom 0.254: v13.5,28.75 9.25,28.75 v9,29 TP13.TP
LED_S1  (via drill 0.35)
  Top 0.254: U1.30 9.25,14.75 7.75,16.25 7.75,17.75 6.5,19 TP14.TP v6.88,27.88 | U5.2 15,27.25 14.5,26.75 14.5,26.65 R4.1 13.5,26.5 13.25,26.25 10.5,26.25 10.25,26.5 v9.75,26.5
  Bottom 0.254: v9.75,26.5 8.25,26.5 v6.88,27.88 TP14.TP
LED_STROBE  (via drill 0.35)
  Top 0.254: U3.4 11.25,30 11,30.25 10,30.25 9.75,30 v7.75,30 6,28.25 v6,18.5 | U1.31 9,14.25 8,15.25 v7.75,15.25
  Bottom 0.254: v6,18.5 7,18.5 7.75,17.75 v7.75,15.25 | v7.75,30 TP15.TP
N$1
  Top 0.254: U5.4 15.65,30.65 16,31 19,31 19.5,31.5 19.5,34.25 19.75,34.5 20.51,34.5 T2.3
N$4
  Top 0.254: U2.P$4 13.55,23.4 13.95,23.8 14.8,23.8 15.15,24.15 C2.1
N$6
  Top 0.254: U4.4 18.65,29.9 19,30.25 20.25,30.25 20.5,30.5 20.5,30.99 T1.3
N$8
  Top 0.254: U1.17 18.02,18.27 18.25,18.5 18.25,19.35 Q1.P$3
N$13
  Top 0.254: U1.18 14.25,19 15,19.75 15.25,19.75 16.7,21.2 Q1.P$1
N$14  (via drill 0.35)
  Top 0.254: CON1.PIN$3 6.05,10.2 v6.5,9.75 7,9.25 R7.1
  Bottom 0.254: TP36.TP 7.25,9.75 v6.5,9.75
N$15  (via drill 0.35)
  Top 0.254: U1.4 12.75,11.5 11.75,10.5 11.25,10.5 11,10.25 11,9.5 10,8.5 v9.75,8.5 | R6.2 9,10.75 v9.75,10
  Bottom 0.254: v9.75,8.5 v9.75,10
N$17
  Top 0.254: U1.3 12.25,11.75 11.5,11 11,11 10.5,10.5 10.5,9.75 10,9.25 R7.2
N$18
  Top 0.254: U3.23 4.5,28 5.5,27 5.5,24.75 5,24.25 R1.2
N$21  (via drill 0.35)
  Top 0.254: CON1.PIN$2 v6.5,10.85 7.5,10.85 R6.1
  Bottom 0.254: TP35.TP 7.5,11.85 v6.5,10.85
R0  (via drill 0.35)
  Top 0.254: U3.5 9.5,31 7.25,33.25 7.25,40.5 6.75,41 6.75,42 v7,42.25 7.25,42.5 7.25,68.75 6.75,69.25 6.75,71.5 v7.25,72 | TP18.TP D6.2 | v12,72 D1.2
  Bottom 0.254: v7.25,72 v12,72 | v7,42.25 11.75,42.25 TP18.TP
  other vias: 12,42
R1  (via drill 0.35)
  Top 0.254: D2.2 v12,78 | v18.5,78 18.75,78 19.5,77.25 19.5,69.5 19.75,69.25 19.75,55.5 20.25,55 20.25,48.25 v20,48 20.25,47.75 20.25,39.75 v20,39.5 | v16.75,36.5 15.25,36.5 13.25,34.5 13.25,34.25 13,34 U3.8 | D7.2 TP21.TP
  Bottom 0.254: v12,78 v18.5,78 | v20,39.5 19.75,39.5 v16.75,36.5 | TP21.TP v20,48
  other vias: 12,48
R2  (via drill 0.35)
  Top 0.254: U3.11 13.5,37 v15.25,38.75 | v18,41 18.75,41.75 18.75,42.25 18.25,42.75 18.25,51.5 18.75,52 18.75,53.75 v18.5,54 18.25,54.25 18.25,68.5 17.25,69.5 17.25,81.5 17.75,82 17.75,82.5 17,83.25 v17,84 | v12,84 D3.2 | D8.2 TP24.TP
  Bottom 0.254: v15.25,38.75 17.5,41 v18,41 | TP24.TP v18.5,54 | v17,84 v12,84
  other vias: 12,54
R3  (via drill 0.35)
  Top 0.254: U3.14 3,37 2.75,37.25 2.75,38.5 3.25,39 3.25,44.5 3.75,45 3.75,54.75 3.25,55.25 3.25,59.75 v3.5,60 3.25,60.25 3.25,74.5 5.25,76.5 5.25,84.75 4.75,85.25 4.75,88.75 v6,90 | v12,90 D4.2 | TP27.TP D9.2
  Bottom 0.254: v6,90 v12,90 | v3.5,60 TP27.TP
  other vias: 12,60
R4  (via drill 0.35)
  Top 0.254: U3.17 4.5,34 5.75,35.25 5.75,39.75 5.25,40.25 5.25,43.5 5.75,44 5.75,63.5 5.25,64 5.25,66 | TP30.TP D10.2 | 5.25,66 5.25,73.5 7.25,75.5 7.25,93 6.75,93.5 6.75,95.5 v7.25,96 | v12,96 D5.2 | v5.5,66 5.25,66
  Bottom 0.254: v5.5,66 TP30.TP | v7.25,96 v12,96
  other vias: 12,66
RESET  (via drill 0.35)
  Top 0.254: U1.19 13.75,19.25 v15.25,20.75
  Bottom 0.254: TP1.TP 15.5,13.75 15.5,15.75 16.5,16.75 16.5,20.25 16,20.75 v15.25,20.75
RX  (via drill 0.35)
  Top 0.254: U1.13 21.25,15.75 v21.5,15.5
  Bottom 0.254: v21.5,15.5 TP7.TP
S0  (via drill 0.35)
  Top 0.61: T1.1 18.5,31.98 v18.5,33.5 | v19.5,38 17,40.5 TP33.TP 17,68 16,69 16,70.2 | 16,70.2 16,72 | 16,72 16,73.8 | 16,73.8 16,76.2 | 16,76.2 16,78 | 16,78 16,79.8 | 16,79.8 16,82.2 | 16,82.2 16,84 | 16,84 16,85.8 | 16,85.8 16,88.2 | 16,88.2 16,90 | 16,90 16,91.8 | 16,91.8 16,94.2 | 16,94.2 16,96 | 16,96 16,97.8 D5.6 | D5.5 16,96 | D5.4 16,94.2 | D4.6 16,91.8 | D4.5 16,90 | D4.4 16,88.2 | D3.6 16,85.8 | D3.5 16,84 | D3.4 16,82.2 | D2.6 16,79.8 | D2.5 16,78 | D2.4 16,76.2 | D1.6 16,73.8 | D1.5 16,72 | D1.4 16,70.2
  Bottom 0.61: v18.5,33.5 19.5,34.5 v19.5,38
  other vias: 17,45
S1  (via drill 0.35)
  Top 0.61: T2.1 18.48,37.52 16,40 16,40.2 | 16,40.2 16,42 | 16,42 TP34.TP 16,43.8 | 16,43.8 16,46.2 | 16,46.2 16,48 | 16,48 16,49.8 | 16,49.8 16,52.2 | 16,52.2 16,54 | 16,54 16,55.8 | 16,55.8 16,58.2 | 16,58.2 16,60 | 16,60 16,61.8 | 16,61.8 16,64.2 | 16,64.2 16,66 | 16,66 16,67.5 15.7,67.8 D10.6 | D10.5 16,66 | D10.4 16,64.2 | D9.6 16,61.8 | D9.5 16,60 | D9.4 16,58.2 | D8.6 16,55.8 | D8.5 16,54 | D8.4 16,52.2 | D7.6 16,49.8 | D7.5 16,48 | D7.4 16,46.2 | D6.6 16,43.8 | D6.5 16,42 | D6.4 16,40.2
  other vias: 16,43
TCLK  (via drill 0.35)
  Top 0.254: U1.12 18.5,15.25 v18.75,15
  Bottom 0.254: v18.75,15 TP3.TP
TMS  (via drill 0.35)
  Top 0.254: U1.15 16.5,16.75 17,17.25 20.5,17.25 | v21,17.75 20.5,17.25 | 20.5,17.25 20.45,17.3 SW2.2
  Bottom 0.254: 21.25,18 v21,17.75 TP8.TP
TX  (via drill 0.35)
  Top 0.254: U1.14 17,16.25 v17.25,16.5
  Bottom 0.254: TP4.TP 16.5,15.75 v17.25,16.5
VBAT  (via drill 0.35)
  Top 0.61: CON2.+ 6,16.4 v6,12.75 | TP37.TP 9,6.5 15.5,6.5 17.25,8.25 17.25,9 17.75,9.5 18.5,9.5 18.93,9.93 SW1.COM
  Bottom 0.61: v6,12.75 6,11.75 5.5,11.25 5.5,9.5 7,8 TP37.TP
  other vias: 7.5,8

### Text on the board
tPlace: Blinky Pendant by BlinkinLabs
bPlace: for more info: / blinkypendant.com | OE | STB | S0 | CLK | S1 | DATA | Rev D / 2015-05-05 | SCL | SDA | INT1 | TMS | TX | TCLK | RX | RST | ON | D- | 3.3V | D+ | VBAT | GND | 5V | OFF